# Altium schematic sheet S4 - MICROCONTROLLER.SchDoc: STM32 MCU
size A; FIELD_1: 1; FIELD_2: 2; FIELD_3: 3; FIELD_4: 4; FIELD_5: 5; FIELD_6: 6; FIELD_7: 7; FIELD_8: 8; Engineer: M. TALEBI; Organization: MACHINE INTELLIGENCE LAB; Revision: 0; Project: BLUETOOTH SYSTEM STATUS BOARD
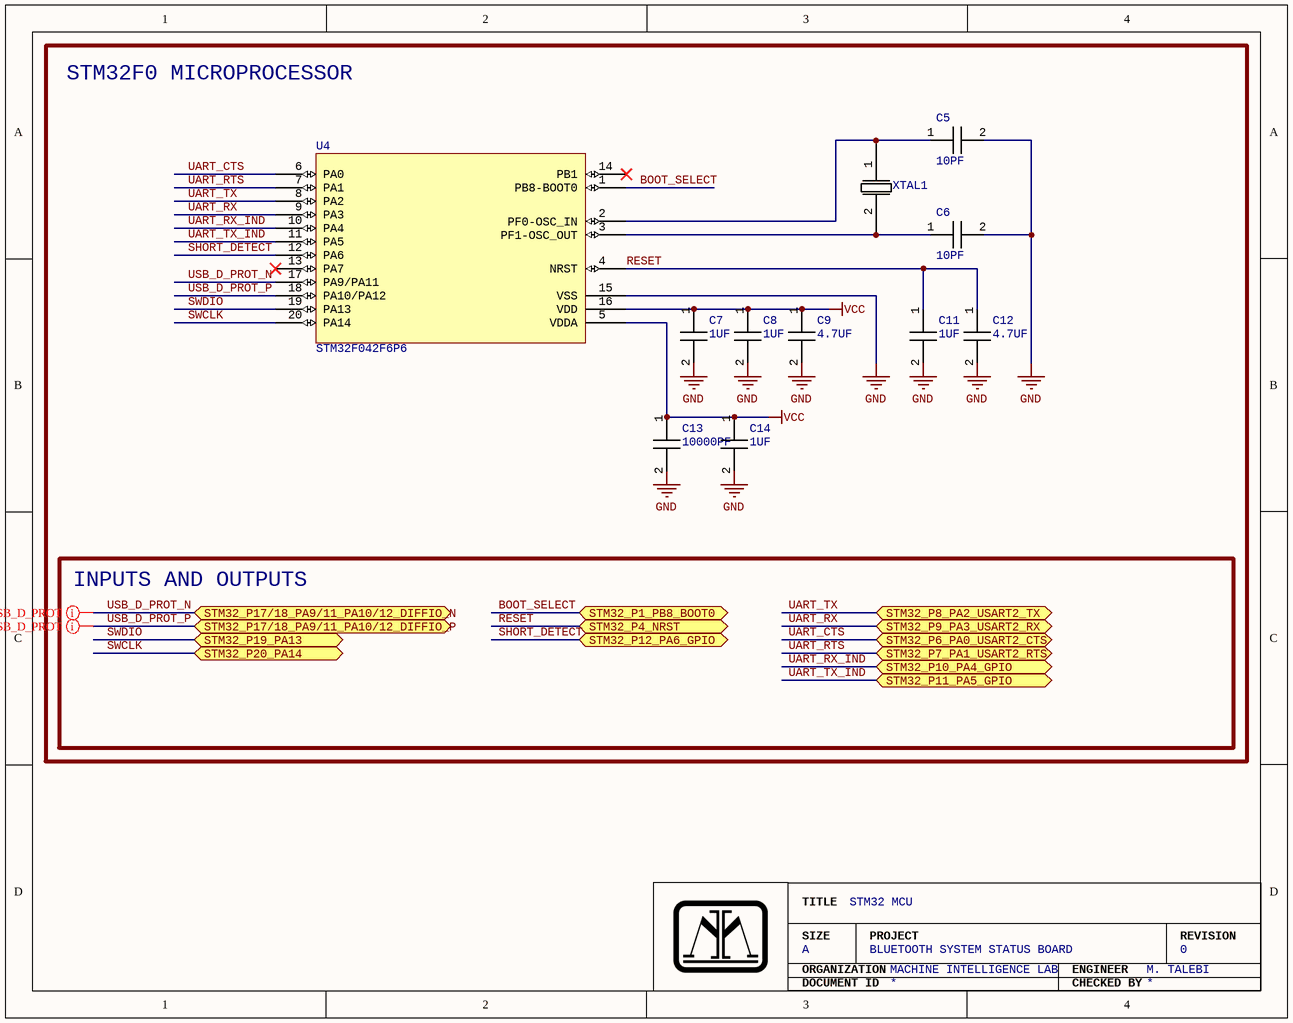
[diagram p0: S4 - MICROCONTROLLER.SchDoc]

## Parts
C5  10PF  [C0603C0G1E100D030BA]
C6  10PF  [C0603C0G1E100D030BA]
C7  1UF  [CL10A105KQ8NNNC]
C8  1UF  [CL10A105KQ8NNNC]
C9  4.7UF  [TMK212AB7475KG-T]
C11  1UF  [CL10A105KQ8NNNC]
C12  4.7UF  [TMK212AB7475KG-T]
C13  10000PF  [C1005X7R1C103K050BA]
C14  1UF  [CL10A105KQ8NNNC]
U4  STM32F042F6P6  [STM32F042F6P6]
XTAL1  ECS-80-20-5PX-TR  [ECS-80-20-5PX-TR]  (value not drawn)

## Ports
STM32_P1_PB8_BOOT0 (bidir), STM32_P4_NRST (bidir), STM32_P6_PA0_USART2_CTS (bidir), STM32_P7_PA1_USART2_RTS (bidir), STM32_P8_PA2_USART2_TX (bidir), STM32_P9_PA3_USART2_RX (bidir), STM32_P10_PA4_GPIO (bidir), STM32_P11_PA5_GPIO (bidir), STM32_P12_PA6_GPIO (bidir), STM32_P17/18_PA9/11_PA10/12_DIFFIO_N (bidir), STM32_P17/18_PA9/11_PA10/12_DIFFIO_P (bidir), STM32_P19_PA13 (bidir), STM32_P20_PA14 (bidir)

## Nets
GND: C5.2 C6.2 C7.2 C8.2 C9.2 C11.2 C12.2 C13.2 C14.2 U4.15(VSS)
VCC: C7.1 C8.1 C9.1 C13.1 C14.1 U4.5(VDDA) U4.16(VDD)
BOOT_SELECT: U4.1(PB8-BOOT0) ; port STM32_P1_PB8_BOOT0
RESET: C11.1 C12.1 U4.4(NRST) ; port STM32_P4_NRST
SHORT_DETECT: U4.12(PA6) ; port STM32_P12_PA6_GPIO
SWCLK: U4.20(PA14) ; port STM32_P20_PA14
SWDIO: U4.19(PA13) ; port STM32_P19_PA13
UART_CTS: U4.6(PA0) ; port STM32_P6_PA0_USART2_CTS
UART_RTS: U4.7(PA1) ; port STM32_P7_PA1_USART2_RTS
UART_RX: U4.9(PA3) ; port STM32_P9_PA3_USART2_RX
UART_RX_IND: U4.10(PA4) ; port STM32_P10_PA4_GPIO
UART_TX: U4.8(PA2) ; port STM32_P8_PA2_USART2_TX
UART_TX_IND: U4.11(PA5) ; port STM32_P11_PA5_GPIO
USB_D_PROT_N: U4.17(PA9/PA11) ; port STM32_P17/18_PA9/11_PA10/12_DIFFIO_N
USB_D_PROT_P: U4.18(PA10/PA12) ; port STM32_P17/18_PA9/11_PA10/12_DIFFIO_P
NetC5_1: C5.1 U4.2(PF0-OSC_IN) XTAL1.1
NetC6_1: C6.1 U4.3(PF1-OSC_OUT) XTAL1.2

Not connected (* = marked no-connect by the designer): U4 13(PA7)* 14(PB1)*

## Layout directives
differential pair: USB_D_PROT_N, USB_D_PROT_P

## Notes on the sheet
- STM32F0 MICROPROCESSOR
- INPUTS AND OUTPUTS
- TITLE
- SIZE
- ORGANIZATION
- A
- PROJECT
- ENGINEER
- REVISION
- DOCUMENT ID
- CHECKED BY

## Library data of the parts
C5 C6 = C0603C0G1E100D030BA: CAP CER 10PF 25V C0G 0201; Tolerance: ±0.5pF; Temperature Coefficient: C0G, NP0; Voltage - Rated: 25V; Operating Temperature: -55°C ~ 125°C; Features: Low ESL; Applications: General Purpose; Mounting Type: Surface Mount, MLCC; Package / Case: 0201 (0603 Metric); Size / Dimension: 0.024" L x 0.012" W (0.60mm x 0.30mm); Thickness (Max): 0.013" (0.33mm); Capacitance: 10 pF; ComponentLink1Description: Datasheet; ComponentLink1URL: https://product.tdk.com/en/system/files?file=dam/doc/product/capacitor/ceramic/mlcc/catalog/mlcc_commercial_general_en.pdf; Supplier 1: Digi-Key; Supplier Part Number 1: 445-4651-1-ND
C7 C8 C11 C14 = CL10A105KQ8NNNC: CAP CER 1UF 6.3V X5R 0603; Tolerance: ±10%; Capacitance: 1 µF; Voltage - Rated: 6.3V; Temperature Coefficient: X5R; Operating Temperature: -55°C ~ 85°C; Applications: General Purpose; Mounting Type: Surface Mount, MLCC; Package / Case: 0603 (1608 Metric); Size / Dimension: 0.063" L x 0.031" W (1.60mm x 0.80mm); Thickness (Max): 0.035" (0.90mm); Supplier 1: Digi-Key; Supplier Part Number 1: 1276-1036-1-ND; ComponentLink1Description: Datasheet; ComponentLink1URL: https://www.samsungsem.com/resources/file/global/support/product_catalog/MLCC.pdf
C9 C12 = TMK212AB7475KG-T: CAP CER 4.7UF 25V X7R 0805; Tolerance: ±10%; Capacitance: 4.7 µF; Voltage - Rated: 25V; Temperature Coefficient: X7R; Operating Temperature: -55°C ~ 125°C; Applications: SMPS Filtering; Mounting Type: Surface Mount, MLCC; Package / Case: 0805 (2012 Metric); Size / Dimension: 0.079" L x 0.049" W (2.00mm x 1.25mm); Thickness (Max): 0.053" (1.35mm); ComponentLink1Description: Datasheet; ComponentLink1URL: https://www.yuden.co.jp/productdata/catalog/mlcc06_e.pdf; Supplier 1: Digi-Key; Supplier Part Number 1: 587-2990-1-ND
C13 = C1005X7R1C103K050BA: CAP CER 10000PF 16V X7R 0402; Tolerance: ±10%; Voltage - Rated: 16V; Temperature Coefficient: X7R; Operating Temperature: -55°C ~ 125°C; Features: Low ESL; Applications: General Purpose; Mounting Type: Surface Mount, MLCC; Package / Case: 0402 (1005 Metric); Size / Dimension: 0.039" L x 0.020" W (1.00mm x 0.50mm); Thickness (Max): 0.022" (0.55mm); Capacitance: 10000 pF; ComponentLink1Description: Datasheet; ComponentLink1URL: https://product.tdk.com/en/system/files?file=dam/doc/product/capacitor/ceramic/mlcc/catalog/mlcc_commercial_general_en.pdf; Supplier 1: Digi-Key; Supplier Part Number 1: 445-1262-1-ND
U4 = STM32F042F6P6: IC MCU 32BIT 32KB FLASH 20TSSOP; Core Processor: ARM® Cortex®-M0; Speed: 48MHz; Connectivity: CANbus, HDMI-CEC, I²C, IrDA, LINbus, SPI, UART/USART, USB; Peripherals: DMA, I²S, POR, PWM, WDT; Program Memory Size: 32KB (32K x 8); RAM Size: 6K x 8; Voltage - Supply (Vcc/Vdd): 1.65V ~ 3.6V; Data Converters: A/D 12x12b; Oscillator Type: Internal; Number of I/O: 16; Core Size: 32-Bit; Supplier Part Number 1: 42Y1015; Program Memory Type: FLASH; Operating Temperature: -40°C ~ 85°C (TA); Mounting Type: Surface Mount; Package / Case: 20-TSSOP (0.173", 4.40mm Width); Supplier Device Package: 20-TSSOP; Supplier 1: Newark; ComponentLink1Description: Datasheet; ComponentLink1URL: https://www.st.com/content/ccc/resource/technical/document/datasheet/52/ad/d0/80/e6/be/40/ad/DM00105814.pdf/files/DM00105814.pdf/jcr:content/translations/en.DM00105814.pdf
XTAL1 = ECS-80-20-5PX-TR: CRYSTAL 8.0000MHZ 20PF SMD; Frequency Stability: ±50ppm; Frequency Tolerance: ±30ppm; Operating Mode: Fundamental; Frequency: 8 MHz; ESR (Equivalent Series Resistance): 60 Ohms; Type: MHz Crystal; Load Capacitance: 20pF; Operating Temperature: -10°C ~ 70°C; Mounting Type: Surface Mount; Package / Case: HC-49/US; Size / Dimension: 0.449" L x 0.189" W (11.40mm x 4.80mm); Height - Seated (Max): 0.169" (4.30mm); ComponentLink1Description: Datasheet; ComponentLink1URL: https://ecsxtal.com/store/pdf/csm-7x.pdf